# EAGLE design LAMPS_1-41 (EAGLE 6.3)
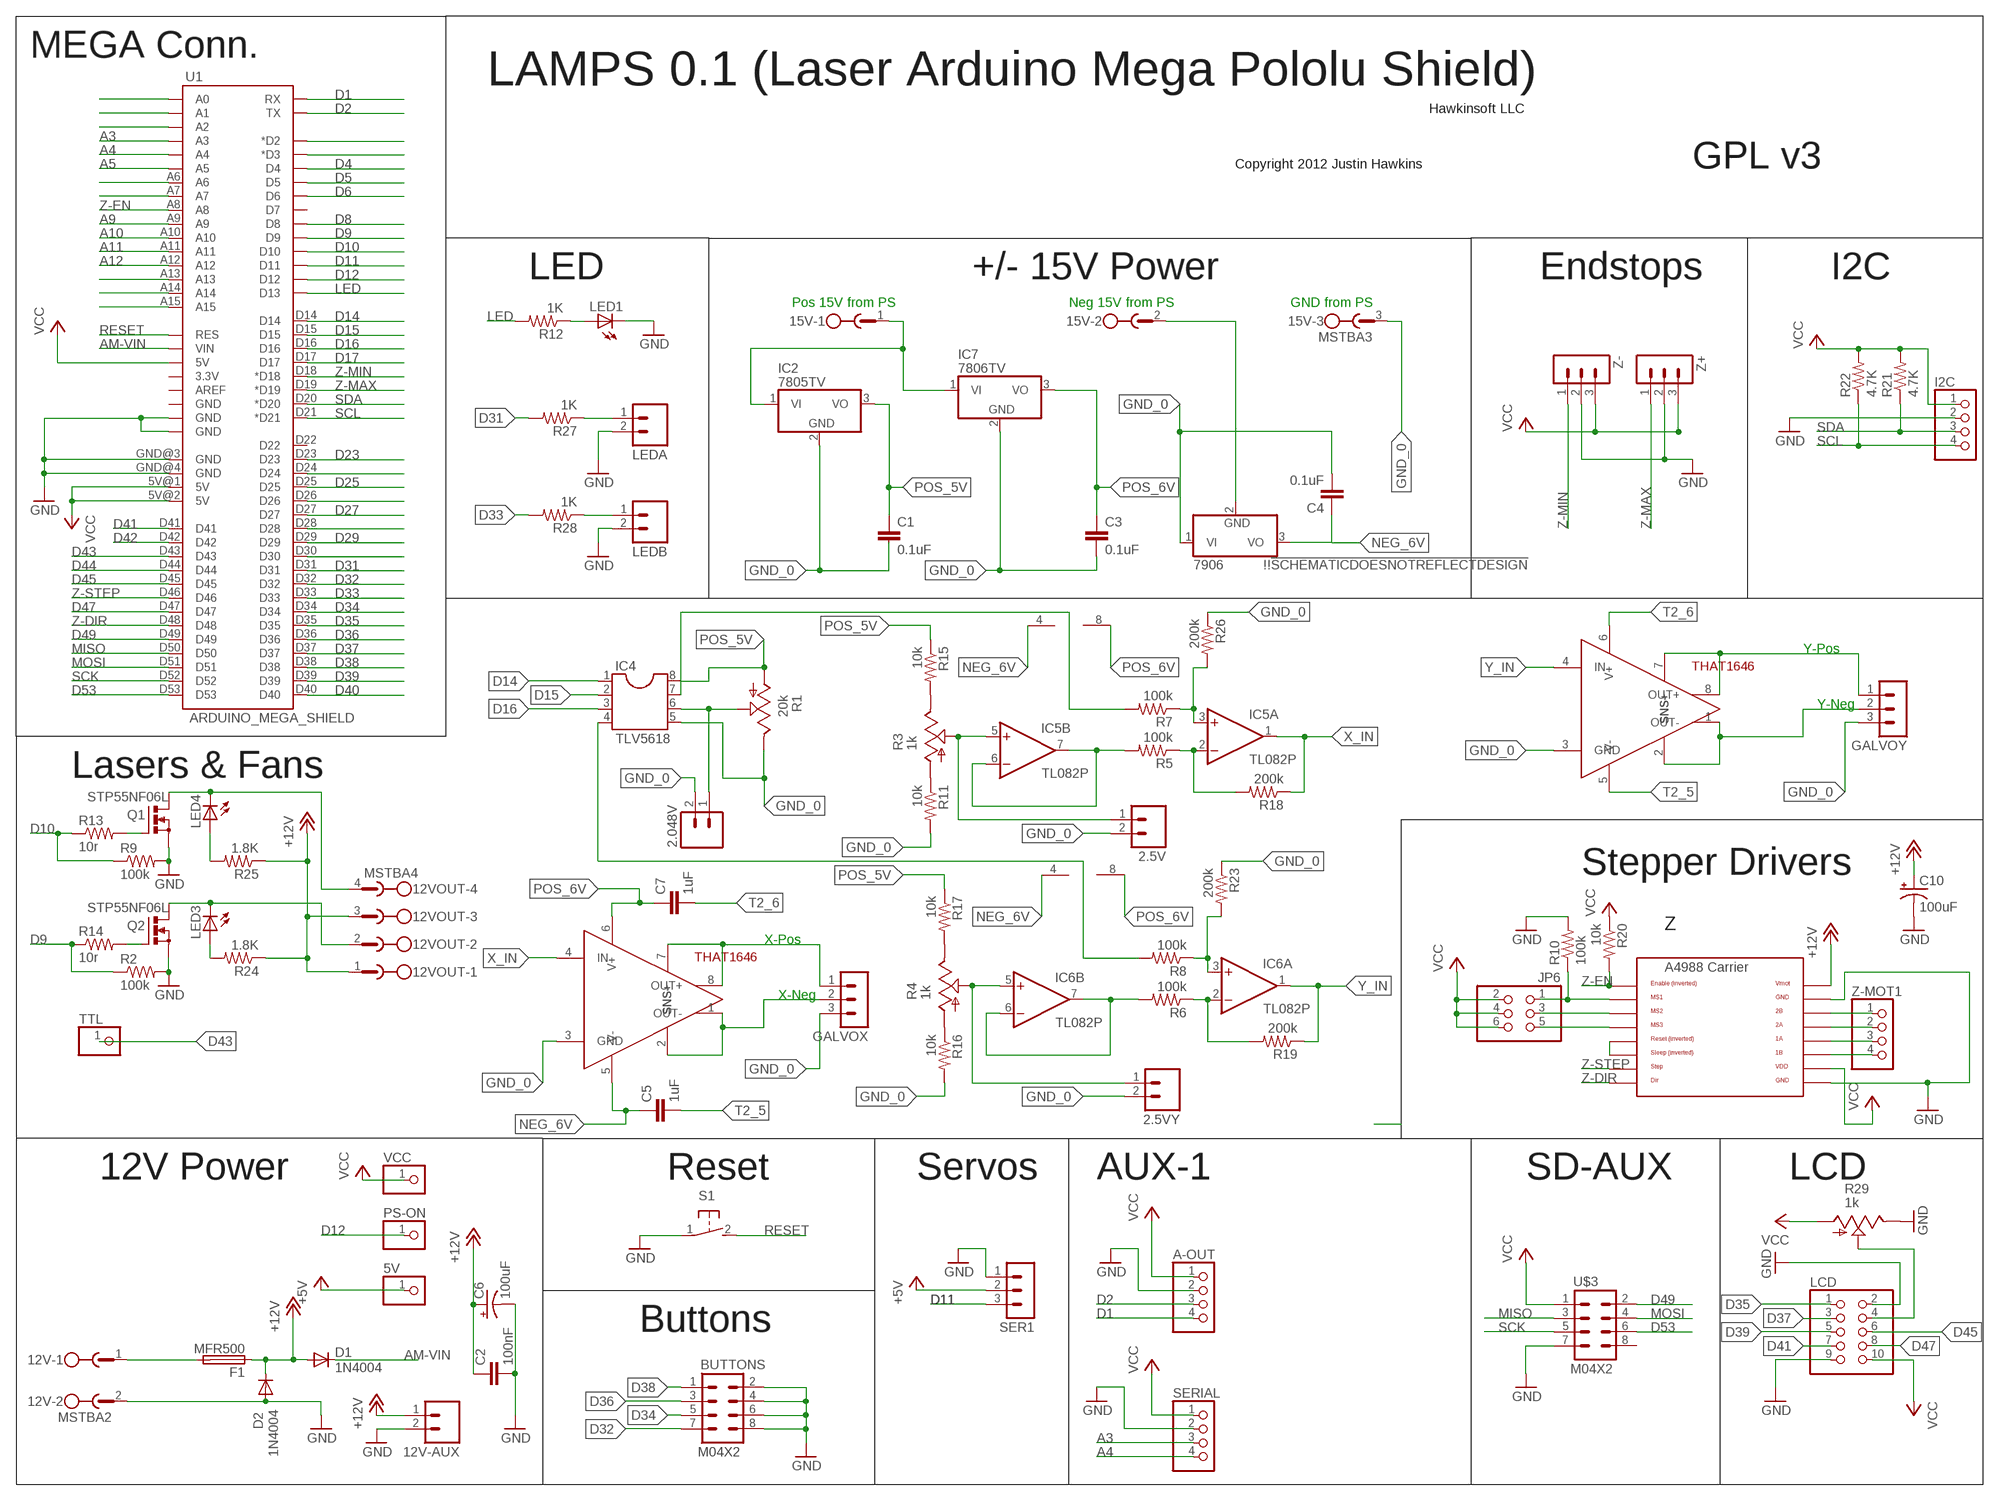
[diagram p0: schematic, sheet 1]

## Parts
2.5V  M02PTH  [1X02]
2.5VY  M02PTH  [1X02]
2.048V  M02PTH  [1X02]
5V  PINHD-1X1  [1X01]
12V  MSTBA2  [MSTBA2]
12V-AUX  M02PTH  [1X02]
12VOUT  MSTBA4  [MSTBA4]
15V  MSTBA3  [MSTBA3]
!!!SCHEMATICDOESNOTREFLECTDESIGN  7906  7805TV  [TO220V]
A-OUT  PINHD-1X4  [1X04]
BUTTONS  M04X2  [2X4]
C1  0.1uF  C2.5/2  [C2.5-2]
C2  100nF  C-EUC0805  [C0805]
C3  0.1uF  C2.5/2  [C2.5-2]
C4  0.1uF  C2.5/2  [C2.5-2]
C5  1uF  C2.5/2  [C2.5-2]
C6  100uF  CPOL-US153CLV-0605  [153CLV-0605]
C7  1uF  C2.5/2  [C2.5-2]
C10  100uF  CPOL-US153CLV-0605  [153CLV-0605]
D1  1N4004  [DO41-10]
D2  1N4004  [DO41-10]
F1  MFR500  PTCFUSE  [MFR500]
GALVOX  3PIN-HEADER  [3PIN-HEADER]
GALVOY  3PIN-HEADER  [3PIN-HEADER]
I2C  PINHD-1X4  [1X04]
IC2  7805TV  [TO220V]
IC4  TLV5618  DIL8S  [SOCKET-08]
IC5  TL082P  [DIL08]
IC6  TL082P  [DIL08]
IC7  7806TV  7805TV  [TO220V]
JP6  PINHD-2X3  [2X03]
LCD  PINHD-2X5  [2X05]
LED1  LEDCHIP-LED0805  [CHIP-LED0805]
LED3  LEDCHIP-LED0805  [CHIP-LED0805]
LED4  LEDCHIP-LED0805  [CHIP-LED0805]
LEDA  M02PTH  [1X02]
LEDB  M02PTH  [1X02]
PS-ON  PINHD-1X1  [1X01]
Q1  STP55NF06L  IRF512  [TO220BV]
Q2  STP55NF06L  IRF512  [TO220BV]
R1  20k  TRIM_US-B25P  [B25P]
R2  100k  R-US_R0805  [R0805]
R3  1k  TRIM_US-B25P  [B25P]
R4  1k  TRIM_US-B25P  [B25P]
R5  100k  R-US_R0805  [R0805]
R6  100k  R-US_R0805  [R0805]
R7  100k  R-US_R0805  [R0805]
R8  100k  R-US_R0805  [R0805]
R9  100k  R-US_R0805  [R0805]
R10  100k  R-US_R0805  [R0805]
R11  10k  R-US_R0805  [R0805]
R12  1K  R-US_R0805  [R0805]
R13  10r  R-US_R0805  [R0805]
R14  10r  R-US_M0805  [M0805]
R15  10k  R-US_R0805  [R0805]
R16  10k  R-US_R0805  [R0805]
R17  10k  R-US_R0805  [R0805]
R18  200k  R-US_R0805  [R0805]
R19  200k  R-US_R0805  [R0805]
R20  10k  R-US_R0805  [R0805]
R21  4.7K  R-US_R0805  [R0805]
R22  4.7K  R-US_R0805  [R0805]
R23  200k  R-US_R0805  [R0805]
R24  1.8K  R-US_R0805  [R0805]
R25  1.8K  R-US_R0805  [R0805]
R26  200k  R-US_R0805  [R0805]
R27  1K  R-US_R0805  [R0805]
R28  1K  R-US_R0805  [R0805]
R29  1k  TRIM_US-B25P  [B25P]
S1  31-XX  [B3F-31XX]
SER1  3PIN-HEADER  [3PIN-HEADER]
SERIAL  PINHD-1X4  [1X04]
TTL  PINHD-1X1  [1X01]
U1  ARDUINO_MEGA_SHIELD  [ARDUINO_MEGA_SHIELD]
U$1  THAT1646  [THAT1646]
U$3  M04X2  [2X4]
U$4  THAT1646  [THAT1646]
U$8  A4988BREAKOUT  [A4988BREAKOUT]
VCC  PINHD-1X1  [1X01]
Z+  3PIN-HEADER  [3PIN-HEADER]
Z-  3PIN-HEADER  [3PIN-HEADER]
Z-MOT1  PINHD-1X4  [1X04]

## Nets
+5V: 5V.1 SER1.2
+12V [power]: 12V-AUX.1 12VOUT.1 12VOUT.3 C2.1 C6.+ C10.+ D1.A D2.C F1.1 R24.1 R25.1 U$8.VMOT
A3: SERIAL.3 U1.A3
A4: SERIAL.4 U1.A4
A5: U1.A5
A9: U1.A9
A10: U1.A10
A11: U1.A11
A12: U1.A12
AM-VIN [power]: D1.C U1.VIN
D1: A-OUT.4 U1.RX
D2: A-OUT.3 U1.TX
D4: U1.D4
D5: U1.D5
D6: U1.D6
D8: U1.D8
D9: R2.1 R14.1 U1.D9
D10: R9.1 R13.1 U1.D10
D11: SER1.3 U1.D11
D12: PS-ON.1 U1.D12
D14: IC4.1 U1.D14
D15: IC4.2 U1.D15
D16: IC4.3 U1.D16
D17: U1.D17
D23: U1.D23
D25: U1.D25
D27: U1.D27
D29: U1.D29
D31: R27.2 U1.D31
D32: BUTTONS.7 U1.D32
D33: R28.2 U1.D33
D34: BUTTONS.5 U1.D34
D35: LCD.1 U1.D35
D36: BUTTONS.3 U1.D36
D37: LCD.3 U1.D37
D38: BUTTONS.1 U1.D38
D39: LCD.5 U1.D39
D40: U1.D40
D41: LCD.7 U1.D41
D42: U1.D42
D43: TTL.1 U1.D43
D44: U1.D44
D45: LCD.6 U1.D45
D47: LCD.8 U1.D47
D49: U1.D49 U$3.2
D53: U1.D53 U$3.6
E0-DIR: U1.D28
E0-EN: U1.D24
E0-STEP: U1.D26
E1-EN: U1.D30
GND: 12V-AUX.2 12V.2 A-OUT.2 BUTTONS.2 BUTTONS.4 BUTTONS.6 BUTTONS.8 C2.2 C6.- C10.- D2.A I2C.2 LCD.2 LCD.9 LED1.C LEDA.2 LEDB.2 Q1.S Q2.S R2.2 R9.2 R10.2 R29.E S1.1(P) SER1.1 SERIAL.2 U1.GND@0(GND) U1.GND@1(GND) U1.GND@3(GND) U1.GND@4(GND) U$3.7 U$8.GND U$8.GND@0(GND) Z+.2 Z-.2
GND_0: 2.5V.2 2.5VY.2 2.048V.2 15V.3 !!!SCHEMATICDOESNOTREFLECTDESIGN.1(VI) C1.2 C3.2 C4.2 GALVOX.3 GALVOY.3 IC2.2(GND) IC4.5 IC7.2(GND) R1.E R11.2 R16.2 R23.1 R26.1 U$1.3(GND) U$4.3(GND)
LED: R12.2 U1.D13
MISO: U1.D50 U$3.3
MOSI: U1.D51 U$3.4
N$1: 12VOUT.2 LED3.C Q2.D
N$2 [power]: 15V.1 IC2.1(VI) IC7.1(VI)
N$3 [power]: 15V.2 !!!SCHEMATICDOESNOTREFLECTDESIGN.2(GND)
N$4: R4.A R16.1
N$5: R4.E R17.2
N$6: 2.048V.1 IC4.6 R1.S
N$7: 12VOUT.4 LED4.C Q1.D
N$8: R3.A R11.1
N$9: R3.E R15.2
N$10: 2.5VY.1 IC6.5(B:+IN) R4.S
N$11: 2.5V.1 IC5.5(B:+IN) R3.S
N$12: GALVOX.2 U$1.1(OUT-) U$1.2(SNS-)
N$13: GALVOX.1 U$1.7(SNS+) U$1.8(OUT+)
N$14: IC5.6(B:-IN) IC5.7(B:OUT) R5.2
N$15: IC5.2(A:-IN) R5.1 R18.2
N$16: IC4.7 R7.2
N$17: IC5.3(A:+IN) R7.1 R26.2
N$18: IC6.6(B:-IN) IC6.7(B:OUT) R6.2
N$19: LEDA.1 R27.1
N$20: IC6.2(A:-IN) R6.1 R19.2
N$21: IC4.4 R8.2
N$22: IC6.3(A:+IN) R8.1 R23.2
N$23: LEDB.1 R28.1
N$24: GALVOY.2 U$4.1(OUT-) U$4.2(SNS-)
N$25: GALVOY.1 U$4.7(SNS+) U$4.8(OUT+)
N$29: LCD.4 R29.S
N$37: JP6.3 U$8.MS2
N$38: U$8.RST U$8.SLP(SLEEP)
N$39: JP6.5 U$8.MS3
N$40: JP6.1 R10.1 U$8.MS1
N$41: U$8.2B Z-MOT1.1
N$42: U$8.2A Z-MOT1.2
N$43: U$8.1A Z-MOT1.3
N$44: U$8.1B Z-MOT1.4
N$45: LED3.A R24.2
N$46: LED1.A R12.1
N$47: Q2.G R14.2
N$48: Q1.G R13.2
N$50: LED4.A R25.2
N$54 [power]: 12V.1 F1.2
NEG_6V: !!!SCHEMATICDOESNOTREFLECTDESIGN.3(VO) C4.1 C5.1 IC5.4(P:V-) IC6.4(P:V-) U$1.5(V-)
POS_5V: C1.1 IC2.3(VO) IC4.8 R1.A R15.1 R17.1
POS_6V: C3.1 C7.1 IC5.8(P:V+) IC6.8(P:V+) IC7.3(VO) U$1.6(V+)
RESET: S1.2(S) U1.RES
SCK: U1.D52 U$3.5
SCL: I2C.4 R22.1 U1.D21(*D21)
SDA: I2C.3 R21.1 U1.D20(*D20)
T2_5: C5.2 U$4.5(V-)
T2_6: C7.2 U$4.6(V+)
THERM0: U1.A13
THERM1: U1.A14
THERM2: U1.A15
VCC: A-OUT.1 I2C.1 JP6.2 JP6.4 JP6.6 LCD.10 R20.1 R21.2 R22.2 R29.A SERIAL.1 U1.5V@0(5V) U1.5V@1(5V) U1.5V@2(5V) U$3.1 U$8.VDD VCC.1 Z+.3 Z-.3
X-DIR: U1.A1
X-MAX: U1.D2(*D2)
X-MIN: U1.D3(*D3)
X-STEP: U1.A0
X_IN: IC5.1(A:OUT) R18.1 U$1.4(IN)
Y-DIR: U1.A7
Y-EN: U1.A2
Y-STEP: U1.A6
Y_IN: IC6.1(A:OUT) R19.1 U$4.4(IN)
Z-DIR: U1.D48 U$8.DIR
Z-EN: R20.2 U1.A8 U$8.EN
Z-MAX: U1.D19(*D19) Z+.1
Z-MIN: U1.D18(*D18) Z-.1
Z-STEP: U1.D46 U$8.STEP
Unconnected: U1.3.3V U1.AREF U1.D7 U1.D22 U1.GND@2(GND) U$3.8

## Notes on the sheet
- MEGA Conn.
- LAMPS 0.1 (Laser Arduino Mega Pololu Shield)
- Hawkinsoft LLC
- Copyright 2012 Justin Hawkins | GPL v3
- LED | +/- 15V Power | Endstops | I2C
- Pos 15V from PS | Neg 15V from PS | GND from PS
- Y-Pos
- Y-Neg
- Lasers & Fans
- Stepper Drivers
- Z
- X-Pos
- X-Neg
- 12V Power | Reset | Servos | AUX-1 | SD-AUX | LCD
- Buttons

## Library data of the parts
2.5V 2.5VY 2.048V 12V-AUX LEDA LEDB = SparkFun:M02: Header 2 Standard 2-pin 0.1" header. Use with straight break away headers (SKU : PRT-00116), right angle break away headers (PRT-00553), swiss pins (PRT-00743), machine pins (PRT-00117), and female headers (PRT-00115). Molex polarized connector foot print use with SKU : PRT-08233 with associated crimp pins and housings.
5V PS-ON VCC = adafruit:PINHD-1X1: Pin header 1x1 for 0.1" spacing With round pins
12V = con-phoenix-508:MSTBA2: PHOENIX; MF: FARNELL; MPN: 1757242; OC_FARNELL: 3705171; OC_NEWARK: 71C4161
12VOUT = con-phoenix-508:MSTBA4: PHOENIX; MF: FARNELL; MPN: 1757268; OC_FARNELL: 3705195; OC_NEWARK: 71C4163
15V = con-phoenix-508:MSTBA3: PHOENIX; MF: FARNELL; MPN: 1757255; OC_FARNELL: 3705183; OC_NEWARK: 71C4162
!!!SCHEMATICDOESNOTREFLECTDESIGN IC2 IC7 = linear:78*: Positive VOLTAGE REGULATOR Source: http://cache.national.com/ds/LM/LM78L05.pdf http://www.fairchildsemi.com/ds/LM/LM7805.pdf
A-OUT I2C SERIAL Z-MOT1 = RepRapjr:PINHD-1X4: PIN HEADER
BUTTONS U$3 = SparkFun:M04X2
C1 C3-C5 C7 = capacitor-wima:C: CAPACITOR naming: grid - package width
C2 = resistor:C-EU: CAPACITOR, European symbol
C6 C10 = adafruit:CPOL-US: POLARIZED CAPACITOR, American symbol
D1 D2 = diode:1N4004: DIODE general purpose rectifier, 1 A
F1 = RepRapjr:PTCFUSE: LITTLEFUSE Picofuse/slow Littlefuse
GALVOX GALVOY SER1 Z+ Z- = ultimachine:3PIN-HEADER: PIN HEADER
IC4 = ic-package:DIL8: Dual In Line / Socket
IC5 IC6 = linear:TL082: OP AMP
JP6 = pinhead:PINHD-2X3: PIN HEADER
LCD = pinhead:PINHD-2X5: PIN HEADER
LED1 LED3 LED4 = led:LED: LED OSRAM: - CHIPLED LG R971, LG N971, LY N971, LG Q971, LY Q971, LO R971, LY R971 LH N974, LH R974 LS Q976, LO Q976, LY Q976 LO Q996 - Hyper CHIPLED LW Q18S LB Q993, LB Q99A, LB R99A - SideLED LS A670, LO A670, LY A670, LG A670, LP A670 LB A673, LV A673, LT A673, LW A673 LH A674 LY A675 LS A676, LA A676, LO A676, LY A676, LW A676 LS A679, LY A679, LG A679 - Hyper Micro SIDELED® LS Y876, LA Y876, LO Y876, LY Y876 LT Y87S - SmartLED LW L88C, LW L88S LB L89C, LB L89S, LG L890 LS L89K, LO L89K, LY L89K LS L896, LA L896, LO L896, LY L896 - TOPLED LS T670, LO T670, LY T670, LG T670, LP T670 LSG T670, LSP T670, LSY T670, LOP T670, LYG T670 LG T671, LOG T671, LSG T671 LB T673, LV T673, LT T673, LW T673 LH T674 LS T676, LA T676, LO T676, LY T676, LB T676, LH T676, LSB T676, LW T676 LB T67C, LV T67C, LT T67C, LS T67K, LO T67K, LY T67K, LW E67C LS E67B, LA E67B, LO E67B, LY E67B, LB E67C, LV E67C, LT E67C LW T67C LS T679, LY T679, LG T679 LS T770, LO T770, LY T770, LG T770, LP T770 LB T773, LV T773, LT T773, LW T773 LH T774 LS E675, LA E675, LY E675, LS T675 LS T776, LA T776, LO T776, LY T776, LB T776 LHGB T686 LT T68C, LB T68C - Hyper Mini TOPLED® LB M676 - Mini TOPLED Santana® LG M470 LS M47K, LO M47K, LY M47K Source: http://www.osram.convergy.de LUXEON: - LUMILED® LXK2-PW12-R00, LXK2-PW12-S00, LXK2-PW14-U00, LXK2-PW14-V00 LXK2-PM12-R00, LXK2-PM12-S00, LXK2-PM14-U00 LXK2-PE12-Q00, LXK2-PE12-R00, LXK2-PE12-S00, LXK2-PE14-T00, LXK2-PE14-U00 LXK2-PB12-K00, LXK2-PB12-L00, LXK2-PB12-M00, LXK2-PB14-N00, LXK2-PB14-P00, LXK2-PB14-Q00 LXK2-PR12-L00, LXK2-PR12-M00, LXK2-PR14-Q00, LXK2-PR14-R00 LXK2-PD12-Q00, LXK2-PD12-R00, LXK2-PD12-S00 LXK2-PH12-R00, LXK2-PH12-S00 LXK2-PL12-P00, LXK2-PL12-Q00, LXK2-PL12-R00 Source: www.luxeon.com KINGBRIGHT: KA-3528ASYC Source: www.kingbright.com
Q1 Q2 = transistor-power:IRF512: N-CHANNEL MOS FET
R1 R3 R4 R29 = pot:TRIM_US-: POTENTIOMETER
R2 R5-R12 R15-R28 = adafruit:R-US_: RESISTOR, American symbol
R13 R14 = resistor:R-US_: RESISTOR, American symbol
S1 = switch-omron:31-XX: OMRON SWITCH; MPN: B3F-3100; OC_FARNELL: 959704; OC_NEWARK: 36M3582
TTL = pinhead:PINHD-1X1: PIN HEADER
U1 = RepRapjr:ARDUINO_MEGA_SHIELD
U$1 U$4 = THAT1646:THAT1646: THAT 1646 Balanced Line Driver (DIP) Datasheet: http://www.thatcorp.com/datashts/THAT_1606-1646_Datasheet.pdf
U$8 = RepRapjr:A4988BREAKOUT

## Net classes
1 power: width 1.016 mm

## Board
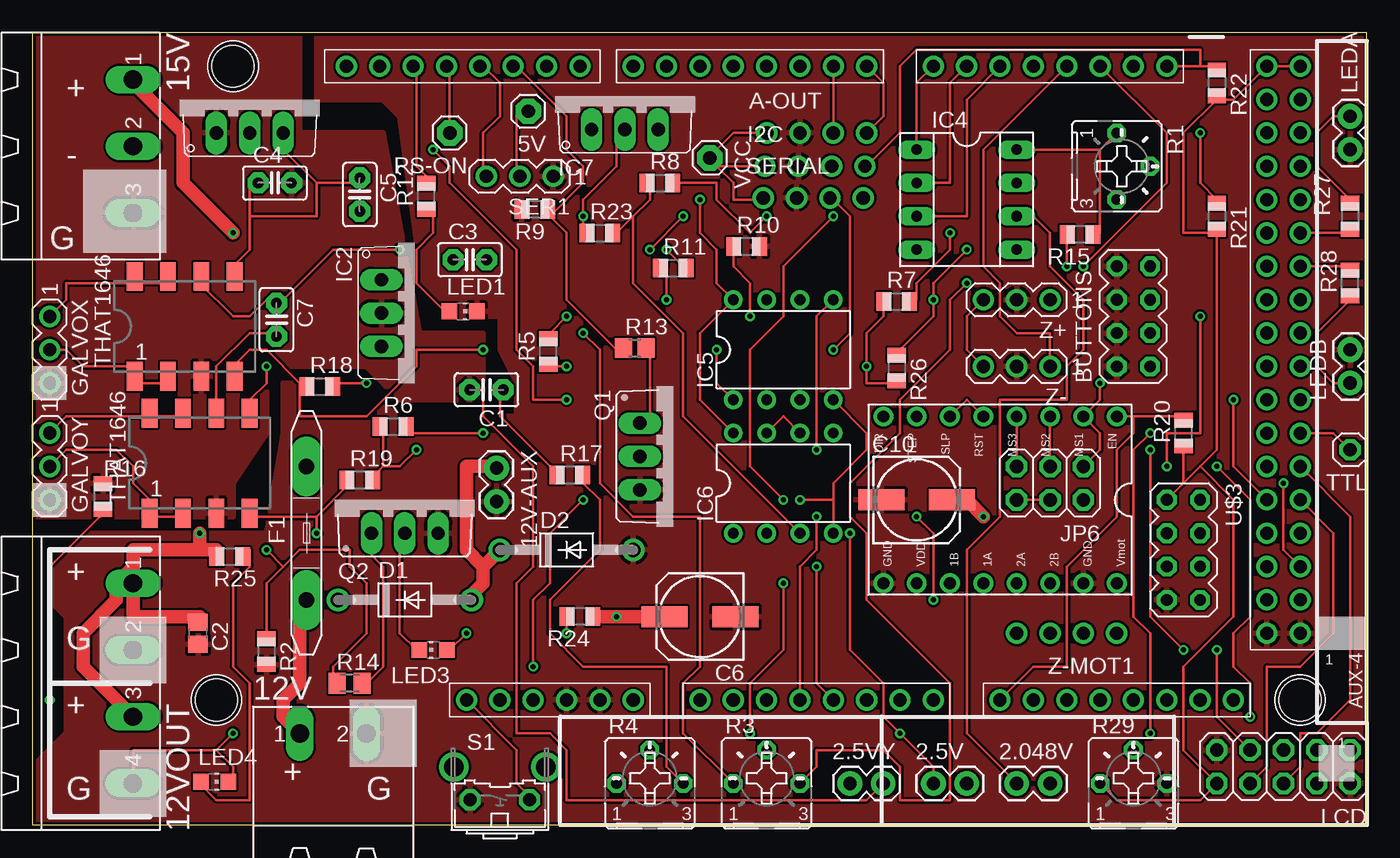
[diagram p1: board, top side]
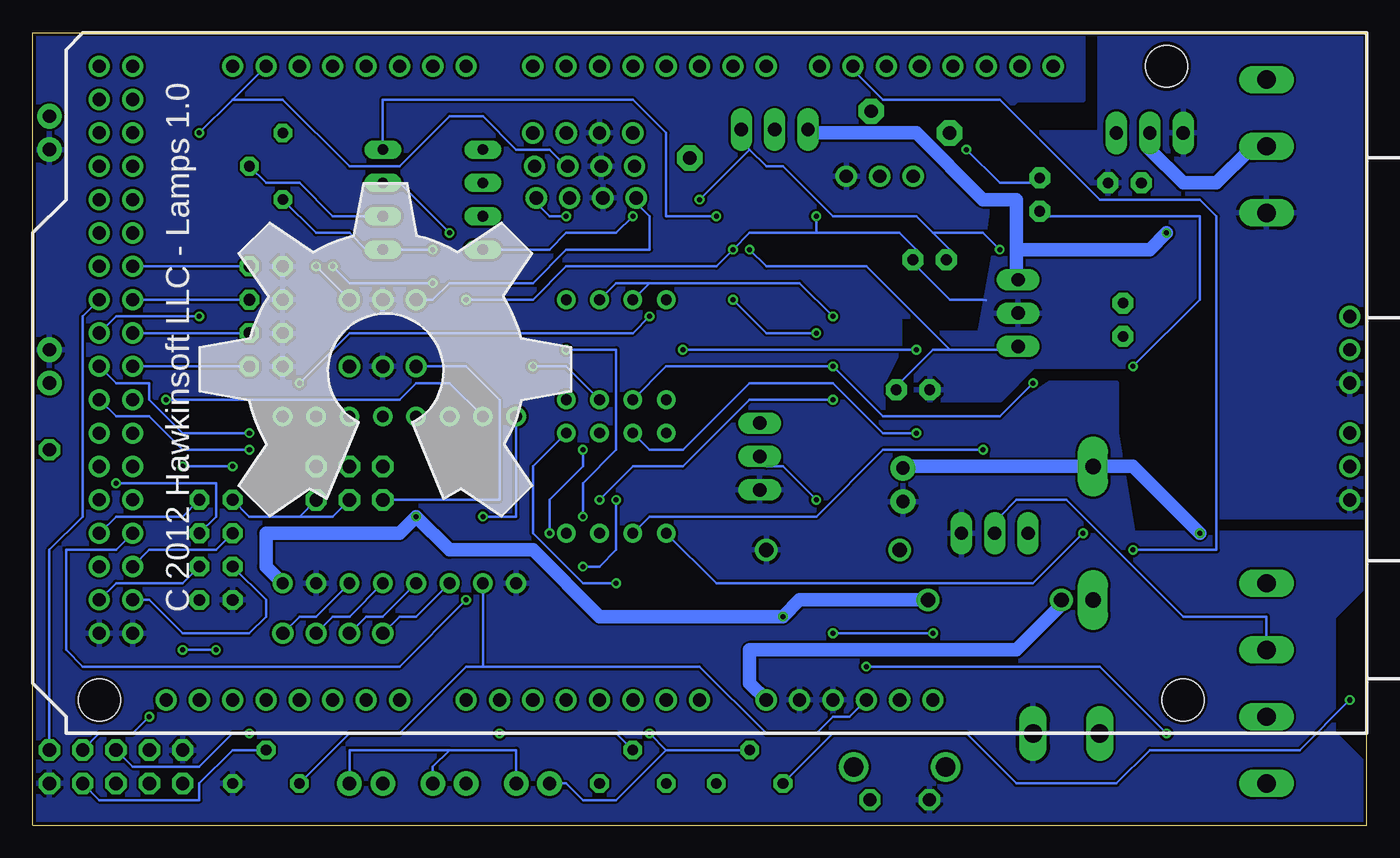
[diagram p2: board, bottom side, seen from below]

Size 101.6 x 60.32 mm. Coordinates in mm from the lower left corner, seen from the top.
Outline: 101.6,60.31 101.6,0 0.01,0
Outline: 0,0 0,60.31
Outline: 101.6,60.32 0.01,60.32
Copper layers (1*16): Top 0.035mm / dielectric 1.5mm / Bottom 0.035mm
Design rules "GoldPhoenix": minimum track width 7mil, minimum drill 15mil, track to track 7mil, track to pad 7mil, pad to pad 7mil, via to via 7mil, smd to smd 7mil, copper to edge 10mil, drill to drill 8mil, minimum pad ring 12mil, minimum via ring 7mil, stop-mask expansion 4mil, vias tented up to drill 25mil, thermal gap 10mil

### Footprints (pad centres in the part's own frame; a part is rotated, then mirrored left to right if it is on the bottom)
1X02 = drill 1.016 pad 1.88: 1 0,0; 2 2.54,0
1X01 = drill 1.016 pad 1.93 octagon: 1 0,0
MSTBA2 = drill 1.397 long: 1 -2.54,5.08; 2 2.54,5.08
MSTBA4 = drill 1.397 long: 1 -7.62,5.08; 2 -2.54,5.08; 3 2.54,5.08; 4 7.62,5.08
MSTBA3 = drill 1.397 long: 1 -5.08,5.08; 2 0,5.08; 3 5.08,5.08
TO220V = drill 1.016 long: 1 -2.54,-2.54; 2 0,-2.54; 3 2.54,-2.54
1X04 = drill 1.016: 1 -2.54,0; 2 0,0; 3 2.54,0; 4 5.08,0
2X4 = drill 0.9 pad 1.422 octagon: 1 -3.81,-1.27; 2 -3.81,1.27; 3 -1.27,-1.27; 4 -1.27,1.27; 5 1.27,-1.27; 6 1.27,1.27; 7 3.81,-1.27; 8 3.81,1.27
C2.5-2 = drill 0.813 pad 1.6 octagon: 1 -1.27,0; 2 1.27,0
C0805 = smd 1.3 x 1.5: 1 -0.85,0; 2 0.85,0
153CLV-0605 = smd 3.5 x 1.6: + 2.7,0; - -2.7,0
DO41-10 = drill 1.118: A 5.08,0; C -5.08,0
MFR500 = drill 1.2 pad 2.3 long: 1 -5.08,0; 2 5.08,0
3PIN-HEADER = drill 1.016: 1 -2.54,0; 2 0,0; 3 2.54,0
SOCKET-08 = drill 0.813 long: 1 -3.81,-3.81; 2 -1.27,-3.81; 3 1.27,-3.81; 4 3.81,-3.81; 5 3.81,3.81; 6 1.27,3.81; 7 -1.27,3.81; 8 -3.81,3.81
DIL08 = drill 0.813 pad 1.27: 1 -3.81,-3.81; 2 -1.27,-3.81; 3 1.27,-3.81; 4 3.81,-3.81; 5 3.81,3.81; 6 1.27,3.81; 7 -1.27,3.81; 8 -3.81,3.81
2X03 = drill 1.016 octagon: 1 -2.54,-1.27; 2 -2.54,1.27; 3 0,-1.27; 4 0,1.27; 5 2.54,-1.27; 6 2.54,1.27
2X05 = drill 1.016 octagon: 1 -5.08,-1.27; 2 -5.08,1.27; 3 -2.54,-1.27; 4 -2.54,1.27; 5 0,-1.27; 6 0,1.27; 7 2.54,-1.27; 8 2.54,1.27; 9 5.08,-1.27; 10 5.08,1.27
CHIP-LED0805 = smd 1.2 x 1.2: A 0,-1.05; C 0,1.05
TO220BV = drill 1.016 long: D 0,-2.54; G -2.54,-2.54; S 2.54,-2.54
B25P = drill 0.813 octagon: A -2.54,0; E 2.54,0; S 0,2.54
R0805 = smd 1.1 x 1.4: 1 -1,0; 2 1,0
R0805' = smd 1.3 x 1.5: 1 -0.85,0; 2 0.85,0
M0805 = smd 1.3 x 1.6: 1 -0.95,0; 2 0.95,0
B3F-31XX = drill 1.016 octagon: 1 -2.261,-1.245; 2 2.261,-1.245 | drill 1.499 pad 2.159: 3 -3.505,1.245; 4 3.505,1.245
1X01' = drill 1.016 octagon: 1 0,0
ARDUINO_MEGA_SHIELD = drill 1 pad 1.422: 3.3V 35.56,2.54; 5V@0 38.1,2.54; 5V@1 93.98,50.8; 5V@2 96.52,50.8; A0 50.8,2.54; A1 53.34,2.54; A2 55.88,2.54; A3 58.42,2.54; A4 60.96,2.54; A5 63.5,2.54; A6 66.04,2.54; A7 68.58,2.54; A8 73.66,2.54; A9 76.2,2.54; A10 78.74,2.54; A11 81.28,2.54; A12 83.82,2.54; A13 86.36,2.54; A14 88.9,2.54; A15 91.44,2.54; AREF 23.876,50.8; D2 58.42,50.8; D3 55.88,50.8; D4 53.34,50.8; D5 50.8,50.8; D6 48.26,50.8; D7 45.72,50.8; D8 41.656,50.8; D9 39.116,50.8; D10 36.576,50.8; D11 34.036,50.8; D12 31.496,50.8; D13 28.956,50.8; D14 68.58,50.8; D15 71.12,50.8; D16 73.66,50.8; D17 76.2,50.8; D18 78.74,50.8; D19 81.28,50.8; D20 83.82,50.8; D21 86.36,50.8; D22 93.98,48.26; D23 96.52,48.26; D24 93.98,45.72; D25 96.52,45.72; D26 93.98,43.18; D27 96.52,43.18; D28 93.98,40.64; D29 96.52,40.64; D30 93.98,38.1; D31 96.52,38.1; D32 93.98,35.56; D33 96.52,35.56; D34 93.98,33.02; D35 96.52,33.02; D36 93.98,30.48; D37 96.52,30.48; D38 93.98,27.94; D39 96.52,27.94; D40 93.98,25.4; D41 96.52,25.4; D42 93.98,22.86; D43 96.52,22.86; D44 93.98,20.32; D45 96.52,20.32; D46 93.98,17.78; D47 96.52,17.78; D48 93.98,15.24; D49 96.52,15.24; D50 93.98,12.7; D51 96.52,12.7; D52 93.98,10.16; D53 96.52,10.16; GND@0 40.64,2.54; GND@1 43.18,2.54; GND@2 26.416,50.8; GND@3 93.98,7.62; GND@4 96.52,7.62; RES 33.02,2.54; RX 63.5,50.8; TX 60.96,50.8; VIN 45.72,2.54 | hole 3.2: 96.52,2.54; 13.97,2.54; 15.24,50.8
THAT1646 = smd 1.2 x 2.2: 1 -3.81,-3.8; 2 -1.27,-3.8; 3 1.27,-3.8; 4 3.81,-3.8; 5 3.81,3.8; 6 1.27,3.8; 7 -1.27,3.8; 8 -3.81,3.8
A4988BREAKOUT = drill 0.9: 1A 8.89,1.27; 1B 11.43,1.27; 2A 6.35,1.27; 2B 3.81,1.27; DIR 16.51,-11.43; EN -1.27,-11.43; GND 16.51,1.27; GND@0 1.27,1.27; MS1 1.27,-11.43; MS2 3.81,-11.43; MS3 6.35,-11.43; RST 8.89,-11.43; SLP 11.43,-11.43; STEP 13.97,-11.43; VDD 13.97,1.27; VMOT -1.27,1.27

### Placement (x,y rotation side)
2.5V  68.59,3.17 0 top
2.5VY  62.24,3.17 0 top
2.048V  74.94,3.17 0 top
5V  37.73,54.36 180 top
12V  22.87,1.9 0 top
12V-AUX  35.32,27.18 270 top
12VOUT  2.55,10.79 270 top
15V  2.55,51.69 270 top
!!!SCHEMATICDOESNOTREFLECTDESIGN  16.52,55.24 0 top
A-OUT  58.43,52.7 0 top
BUTTONS  83.83,38.73 90 top
C1  34.56,33.15 180 top
C2  12.59,14.6 270 top
C3  33.29,43.05 0 top
C4  18.43,48.89 0 top
C5  24.9,48.01 270 top
C6  50.81,15.87 180 top
C7  18.55,38.48 270 top
C10  67.32,24.77 0 top
D1  28.33,17.14 0 top
D2  40.65,20.95 0 top
F1  20.84,22.23 270 top
GALVOX  1.28,36.2 270 top
GALVOY  1.28,27.3 270 top
I2C  58.31,50.16 0 top
IC2  29.1,38.99 270 top
IC4  71.13,47.62 270 top
IC5  57.16,36.2 0 top
IC6  57.16,26.03 0 top
IC7  45.1,55.5 0 top
JP6  77.48,26.03 180 top
LCD  95.26,4.44 180 top
LED1  32.78,39.12 270 top
LED3  30.49,13.33 90 top
LED4  13.86,3.3 270 top
LEDA  100.34,53.97 270 top
LEDB  100.34,33.65 90 top
PS-ON  31.76,52.7 180 top
Q1  48.78,28.07 270 top
Q2  28.33,24.77 0 top
R1  82.56,50.16 270 top
R2  17.79,13.21 270 top
R3  55.89,3.17 0 top
R4  47,3.17 0 top
R5  39.26,36.07 90 top
R6  27.44,30.35 0 top
R7  65.8,39.88 0 top
R8  47.76,48.89 0 top
R9  38.24,46.86 180 top
R10  54.37,44.07 0 top
R11  48.78,42.42 0 top
R12  29.98,47.88 90 top
R13  10r  [R0805']  45.86,36.32 0 top
R14  24.14,10.79 0 top
R15  79.77,44.96 180 top
R16  5.35,25.02 90 top
R17  40.91,26.67 0 top
R18  21.86,33.4 0 top
R19  24.9,26.29 0 top
R20  87.64,29.84 90 top
R21  90.18,46.35 270 top
R22  90.18,56.51 270 top
R23  43.19,45.09 0 top
R24  41.67,15.87 180 top
R25  15,20.45 0 top
R26  65.8,34.8 270 top
R27  100.34,46.35 270 top
R28  100.34,41.27 90 top
R29  83.83,3.17 0 top
S1  35.57,3.17 0 top
SER1  37.1,49.4 180 top
SERIAL  58.18,47.75 0 top
TTL  [1X01']  100.34,28.57 180 top
U1  0.01,6.98 0 top
U$1  11.57,37.97 0 top
U$2  [OSHW_FILLX1000_NOTEXT]  88.91,23.49 0 bottom
U$3  87.64,20.95 270 top
U$4  12.71,27.56 0 top
U$8  81.29,19.69 180 top
VCC  51.57,50.8 270 top
Z+  74.94,40 180 top
Z-  74.94,34.92 180 top
Z-MOT1  80.02,14.6 180 top

### Tracks (layer width: path | path; a pad name or v marks a point on that pad's centre or on a via)
+5V
  Top 0.178: SER1.2 36.84,50.16 36.84,53.97 5V.1
+12V  (via drill 0.38)
  Top 1.016: v72.4,23.49 71.13,24.77 C10.+ | 12.71,20.95 7.63,20.95 7.63,19.69 | 12.71,20.95 13.98,20.95 R25.1 | 7.63,19.69 12VOUT.1 7.63,15.87 12.71,15.87 C2.1 | 12VOUT.3 3.82,12.06 3.82,14.6 6.36,17.14 6.36,18.41 7.63,19.69 | C6.+ v44.46,15.87 R24.1 | 34.3,19.69 34.3,18.41 33.03,17.14 D1.A | D2.C 34.3,19.69 | 34.3,19.69 33.03,20.95 33.03,27.3 35.57,27.3 12V-AUX.1 | v12.71,22.23 12.71,20.95
  Bottom 1.016: U$8.VMOT 83.83,19.69 83.83,22.23 73.67,22.23 v72.4,23.49 69.86,20.95 63.51,20.95 58.43,15.87 v44.46,15.87 43.19,17.14 D1.A 33.03,17.14 | 12V-AUX.1 35.57,27.3 F1.1 17.79,27.3 v12.71,22.23
A3  (via drill 0.38)
  Top 0.178: U1.A3 58.43,19.69 59.7,20.95 v59.7,23.49 | v60.97,36.2 62.24,37.46 62.24,46.35 60.97,47.62 SERIAL.3
  Bottom 0.178: v59.7,23.49 59.7,26.03 57.16,28.57 57.16,36.2 v60.97,36.2
A4  (via drill 0.38)
  Top 0.178: U1.A4 59.7,10.79 v59.7,19.69 | v57.16,24.77 54.62,27.3 54.62,36.2 57.16,38.73 57.16,42.54 v60.97,46.35
  Bottom 0.178: v59.7,19.69 58.43,19.69 57.16,20.95 v57.16,24.77 | v60.97,46.35 62.24,46.35 63.51,47.62 SERIAL.4
AM-VIN
  Bottom 1.016: U1.VIN 47,10.79 47,13.33 26.68,13.33 22.87,17.14 D1.C
D1
  Top 0.178: U1.RX 64.78,56.51 64.78,53.97 A-OUT.4
D2
  Top 0.178: A-OUT.3 U1.TX
D9  (via drill 0.38)
  Top 0.178: R2.1 17.79,18.41 19.06,19.69 | 19.06,19.69 20.33,20.95 24.14,20.95 24.14,19.69 25.41,18.41 25.41,14.6 22.87,12.06 22.87,10.79 R14.1 | 19.06,19.69 v17.79,20.95
  Bottom 0.178: v17.79,20.95 11.44,20.95 11.44,46.35 12.71,47.62 20.33,47.62 27.95,55.24 36.84,55.24 39.38,57.79 U1.D9
D10
  Top 0.178: 39.38,46.35 40.65,45.09 40.65,40 44.46,36.2 R13.1 | 39.38,46.35 41.92,48.89 41.92,50.16 40.65,51.43 40.65,53.97 36.84,57.79 U1.D10 | 39.38,46.35 R9.1
D11
  Top 0.178: U1.D11 34.3,57.79 35.57,56.51 35.57,53.97 34.3,52.7 34.3,50.16 SER1.3
D12
  Top 0.178: PS-ON.1 31.76,57.79 U1.D12
D14
  Top 0.178: IC4.1 67.32,56.51 U1.D14
D15
  Top 0.178: IC4.2 69.86,48.89 69.86,56.51 U1.D15
D16
  Top 0.178: IC4.3 71.13,46.35 71.13,55.24 U1.D16
D31
  Top 0.178: U1.D31 100.34,45.09 R27.2
D32
  Bottom 0.178: U1.D32 BUTTONS.7
D33
  Top 0.178: U1.D33 100.34,42.54 R28.2
D34
  Bottom 0.178: U1.D34 BUTTONS.5
D35
  Bottom 0.178: U1.D35 97.8,38.73 97.8,23.49 100.34,20.95 LCD.1
D36
  Bottom 0.178: U1.D36 BUTTONS.3
D37  (via drill 0.38)
  Top 0.178: v88.91,38.73 88.91,29.84 86.37,29.84 v86.37,27.3 | v90.18,27.3 92.72,24.77 92.72,15.87 91.45,14.6 91.45,12.06 92.72,10.79 v92.72,8.26
  Bottom 0.178: U1.D37 95.26,38.73 v88.91,38.73 | v90.18,27.3 v86.37,27.3 | v92.72,8.26 93.99,6.98 96.53,6.98 LCD.3
D38
  Bottom 0.178: U1.D38 BUTTONS.1
D39  (via drill 0.38)
  Top 0.178: v85.1,29.84 83.83,28.57 83.83,15.87 85.1,14.6 v85.1,6.98
  Bottom 0.178: U1.D39 95.26,33.65 92.72,33.65 92.72,32.38 90.18,29.84 v85.1,29.84 | v85.1,6.98 86.37,6.98 88.91,4.44 93.99,4.44 LCD.5
D41  (via drill 0.38)
  Top 0.178: v85.1,28.57 85.1,15.87 v87.64,13.33 | v90.18,13.33 90.18,8.26 LCD.7
  Bottom 0.178: U1.D41 95.26,31.11 92.72,31.11 90.18,28.57 v85.1,28.57 | v90.18,13.33 v87.64,13.33
D43
  Top 0.178: U1.D43 99.07,29.84 TTL.1
D45
  Top 0.178: U1.D45 100.34,23.49 100.34,9.53 97.8,6.98 96.53,6.98 96.53,4.44 LCD.6
D47
  Top 0.178: U1.D47 99.07,22.23 99.07,14.6 96.53,12.06 93.99,12.06 93.99,4.44 LCD.8
D49
  Bottom 0.178: U$3.2 90.18,23.49 95.26,23.49 U1.D49
D53
  Bottom 0.178: U$3.6 90.18,18.41 95.26,18.41 U1.D53
GND
  pour Top: 101.61,60.32 21.6,60.32 21.6,55.24 26.68,55.24 27.95,53.97 29.98,38.73 35.57,38.73 35.57,36.2 36.84,33.65 36.84,31.11 27.95,31.11 24.14,33.65 19.06,33.65 19.06,29.84 17.79,22.23 0.01,22.23 0.01,18.41 2.55,15.87 2.55,6.98 0.01,4.44 0.01,-0.64 101.61,-0.64
  pour Bottom: 101.61,60.32 21.6,60.32 21.6,55.24 26.68,55.24 27.95,53.97 29.98,38.73 35.57,38.73 35.57,36.2 36.84,33.65 36.84,31.11 27.95,31.11 24.14,33.65 19.06,33.65 19.06,29.84 17.79,22.23 0.01,22.23 0.01,18.41 2.55,15.87 2.55,6.98 0.01,4.44 0.01,-0.64 101.61,-0.64
GND_0  (via drill 0.38)
  Top 0.178: v71.13,43.81 68.59,41.27 v68.59,40 68.59,38.73 66.05,36.2 R26.1 | R23.1 41.92,45.09 v41.92,46.35 41.92,47.62 44.46,50.16 44.46,52.7 IC7.2 | v48.27,43.81 49.54,42.54 R11.2 | 2.5VY.2 63.51,1.9 40.65,1.9 40.65,5.71 39.38,6.98 36.84,6.98 36.84,18.41 38.11,19.69 38.11,27.3 34.3,31.11 34.3,33.91
  Bottom 0.178: v71.13,43.81 IC4.5 76.21,43.81 77.48,45.09 80.02,45.09 R1.E | 41.92,45.09 35.57,45.09 34.3,43.81 C3.2 34.3,42.54 31.76,40 29.22,40 29.02,39.97 | 41.92,45.09 47,45.09 v48.27,43.81 49.54,42.54 60.97,42.54 63.51,40 v68.59,40 | 41.92,45.09 v41.92,46.35 | 2.5VY.2 64.78,5.71 69.86,5.71 | 69.86,5.71 71.13,4.44 2.5V.2 | 2.048V.2 77.48,5.71 69.86,5.71
  pour Top: 20.33,60.32 0.01,60.32 0.01,23.49 15.25,23.49 15.25,26.03 17.79,29.84 17.79,34.92 25.41,34.92 27.95,32.38 34.3,32.38 34.3,37.46 29.48,37.46 26.68,52.7 20.33,52.7
  pour Bottom: 20.33,60.32 0.01,60.32 0.01,23.49 15.25,23.49 15.25,26.03 17.79,29.84 17.79,34.92 25.41,34.92 27.95,32.38 34.3,32.38 34.3,37.46 29.48,37.46 26.68,52.7 20.33,52.7
LED
  Top 0.178: R12.2 30.49,48.89 29.22,50.16 29.22,57.79 U1.D13
MISO
  Bottom 0.178: U$3.3 87.64,20.95 92.72,20.95 U1.D50
MOSI  (via drill 0.38)
  Top 0.178: v95.26,26.03 95.26,20.95 U1.D51
  Bottom 0.178: U$3.4 87.64,23.49 87.64,26.03 v95.26,26.03
N$1
  Top 0.178: LED3.C 29.22,13.33 27.95,14.6 27.95,22.23 Q2.D
  Bottom 0.178: 12VOUT.2 7.63,15.87 13.98,15.87 22.87,24.77 26.68,24.77 27.95,23.49 27.95,22.23 Q2.D
N$2  (via drill 0.38)
  Top 1.016: v15.25,45.09 11.44,48.89 11.44,52.7 7.63,56.51 15V.1
  Bottom 1.016: 26.68,43.81 26.68,47.62 29.22,47.62 34.3,52.7 41.92,52.7 IC7.1 | 26.68,43.81 26.68,41.27 IC2.1 | v15.25,45.09 16.52,43.81 26.68,43.81
N$3
  Bottom 1.016: !!!SCHEMATICDOESNOTREFLECTDESIGN.2 16.52,51.43 13.98,48.89 11.44,48.89 8.9,51.43 7.63,51.43 15V.2
N$4  (via drill 0.38)
  Top 0.178: v1.28,9.53 1.28,19.69 5.09,23.49 R16.1
  Bottom 0.178: v1.28,9.53 5.09,5.71 16.52,5.71 19.06,3.17 26.68,3.17 30.49,6.98 40.65,6.98 R4.A
N$5
  Top 0.178: R4.E 48.27,4.44 48.27,12.06 41.92,12.06 39.38,14.6 39.38,17.14 43.19,20.95 43.19,24.77 41.92,26.03 R17.2
N$6
  Top 0.178: 2.048V.1 71.13,6.98 71.13,20.95 73.67,23.49 73.67,32.38 78.75,32.38 78.75,34.92 80.02,36.2 80.02,40 77.48,42.54 77.48,45.09 76.21,46.35 IC4.6
  Bottom 0.178: IC4.6 78.75,46.35 81.29,48.89 83.83,48.89 R1.S
N$7  (via drill 0.38)
  Top 0.178: 13.98,5.71 15.25,4.44 15.25,3.17 LED4.C | 13.98,5.71 7.63,5.71 12VOUT.4 | v41.92,24.77 39.38,22.23 39.38,18.41 38.11,17.14 v38.11,12.06 | 13.98,5.71 v15.25,6.98
  Bottom 0.178: v41.92,24.77 44.46,27.3 45.73,27.3 Q1.D | v38.11,12.06 20.33,12.06 v15.25,6.98
N$8  (via drill 0.38)
  Top 0.178: v48.27,40 48.27,42.54 R11.1 | v41.92,37.46 43.19,36.2 43.19,26.03 45.73,23.49 50.81,23.49 50.81,12.06 49.54,10.79 49.54,6.98 R3.A
  Bottom 0.178: v48.27,40 45.73,37.46 v41.92,37.46
N$9  (via drill 0.38)
  Top 0.178: v78.75,42.54 78.75,45.09 R15.2 | v71.13,41.27 69.86,40 69.86,36.2 66.05,32.38 66.05,29.84 62.24,26.03 62.24,23.49 63.51,22.23 63.51,17.14 69.86,10.79 69.86,1.9 66.05,1.9 66.05,4.44 64.78,5.71 59.7,5.71 59.7,4.44 R3.E
  Bottom 0.178: v78.75,42.54 77.48,41.27 v71.13,41.27
N$10  (via drill 0.38)
  Top 0.178: v57.16,18.41 57.16,13.33 54.62,10.79 v54.62,6.98
  Bottom 0.178: 53.35,5.71 R4.S | 53.35,5.71 57.16,1.9 59.7,1.9 60.97,3.17 2.5VY.1 | IC6.5 63.51,27.3 63.51,22.23 59.7,18.41 v57.16,18.41 | 53.35,5.71 v54.62,6.98
N$11  (via drill 0.38)
  Top 0.178: 2.5V.1 68.59,4.44 v66.05,6.98 64.78,8.26 64.78,10.79 62.24,13.33 v62.24,22.23 | IC5.5 59.7,38.73 v59.7,28.57
  Bottom 0.178: R3.S 57.16,6.98 v66.05,6.98 | v59.7,28.57 59.7,27.3 62.24,24.77 v62.24,22.23
N$12
  Top 0.178: U$1.2 10.17,33.65 7.63,33.65 U$1.1 7.63,34.92 3.82,34.92 2.55,36.2 GALVOX.2
N$13
  Top 0.178: 7.63,41.27 10.17,41.27 U$1.7 | 7.63,41.27 2.55,41.27 2.55,40 GALVOX.1 | 7.63,41.27 U$1.8
N$14  (via drill 0.38)
  Top 0.178: v40.65,38.73 39.38,37.46 R5.2
  Bottom 0.178: v40.65,38.73 43.19,41.27 54.62,41.27 | IC5.7 54.62,41.27 | IC5.6 57.16,41.27 54.62,41.27
N$15  (via drill 0.38)
  Top 0.178: v25.41,33.65 22.87,33.65 R18.2 | v40.65,34.92 39.38,34.92 R5.1
  Bottom 0.178: v25.41,33.65 27.95,31.11 36.84,31.11 v40.65,34.92 53.35,34.92 IC5.2
N$16  (via drill 0.38)
  Top 0.178: v69.86,45.09 69.86,43.81 67.32,41.27 67.32,40 R7.2
  Bottom 0.178: v69.86,45.09 73.67,48.89 IC4.7
N$17  (via drill 0.38)
  Top 0.178: R26.2 66.05,33.65 63.51,33.65 v63.51,34.92 63.51,37.46 64.78,38.73 64.78,40 R7.1
  Bottom 0.178: IC5.3 60.97,34.92 v63.51,34.92
N$18  (via drill 0.38)
  Top 0.178: v34.3,29.84 27.95,29.84 R6.2 | IC6.6 57.16,31.11 IC6.7
  Bottom 0.178: v34.3,29.84 36.84,29.84 40.65,33.65 47,33.65 52.08,28.57 54.62,28.57 IC6.7
N$19
  Top 0.178: LEDA.1 99.07,53.97 97.8,52.7 97.8,50.16 100.34,47.62 R27.1
N$20  (via drill 0.38)
  Top 0.178: 26.68,27.3 25.41,26.03 R19.2 | 26.68,27.3 26.68,29.84 R6.1 | v29.22,28.57 27.95,27.3 26.68,27.3
  Bottom 0.178: IC6.2 54.62,23.49 41.92,23.49 36.84,28.57 v29.22,28.57
N$21  (via drill 0.38)
  Top 0.178: v55.89,46.35 54.62,45.09 52.08,47.62 52.08,48.89 R8.2 48.27,48.89
  Bottom 0.178: v55.89,46.35 57.16,45.09 60.97,45.09 62.24,43.81 IC4.4
N$22
  Top 0.178: 45.73,46.35 47,47.62 47,48.89 R8.1 | 45.73,46.35 44.46,45.09 R23.2 | IC6.3 49.54,31.11 49.54,37.46 45.73,41.27 45.73,46.35
N$23
  Top 0.178: LEDB.1 99.07,33.65 97.8,34.92 97.8,37.46 100.34,40 R28.1
N$24
  Top 0.178: U$4.2 11.44,23.49 8.9,23.49 U$4.1 8.9,24.77 7.63,26.03 7.63,27.3 6.36,28.57 2.55,28.57 GALVOY.2
N$25
  Top 0.178: 8.9,31.11 11.44,31.11 U$4.7 | 8.9,31.11 2.55,31.11 GALVOY.1 | 8.9,31.11 U$4.8
N$29
  Bottom 0.178: R29.S 86.37,5.71 88.91,3.17 88.91,1.9 96.53,1.9 LCD.4
N$37
  Top 0.178: JP6.3 U$8.MS2
N$38
  Top 0.178: U$8.SLP 71.13,32.38 U$8.RST
N$39
  Top 0.178: JP6.5 U$8.MS3
N$40  (via drill 0.38)
  Top 0.178: v54.62,38.73 54.62,41.27 53.35,42.54 53.35,43.81 R10.1 | v81.29,33.65 81.29,32.38 U$8.MS1 81.29,29.84 81.29,28.57 JP6.1
  Bottom 0.178: v54.62,38.73 55.89,37.46 77.48,37.46 v81.29,33.65
N$41
  Bottom 0.178: U$8.2B 80.02,15.87 81.29,15.87 Z-MOT1.1
N$42
  Bottom 0.178: U$8.2A 77.48,15.87 78.75,15.87 Z-MOT1.2
N$43
  Bottom 0.178: U$8.1A 74.94,15.87 76.21,15.87 Z-MOT1.3
N$44
  Bottom 0.178: U$8.1B 72.4,15.87 73.67,15.87 Z-MOT1.4
N$45  (via drill 0.38)
  Top 0.178: v33.03,14.6 31.76,13.33 LED3.A | v40.65,14.6 40.65,15.87 R24.2
  Bottom 0.178: v40.65,14.6 v33.03,14.6
N$46
  Top 0.178: LED1.A 31.76,38.73 29.22,41.27 29.22,43.81 30.49,45.09 30.49,46.35 R12.1
N$47
  Top 0.178: R14.2 25.41,10.79 26.68,12.06 26.68,19.69 25.41,20.95 25.41,22.23 Q2.G
N$48
  Top 0.178: R13.2 47,36.2 47,31.11 Q1.G
N$50
  Top 0.178: LED4.A 12.71,3.17 13.98,1.9 16.52,1.9 16.52,10.79 15.25,12.06 15.25,18.41 16.52,19.69 16.52,20.95 R25.2
N$54
  Top 1.016: 12V.1 19.06,8.26 19.06,9.53 20.33,10.79 20.33,17.14 F1.2
NEG_6V  (via drill 0.38)
  Top 0.178: 60.97,24.77 60.97,26.03 63.51,28.57 63.51,29.84 IC5.4 | 60.97,24.77 IC6.4 | 16.52,46.35 16.52,48.89 C4.1 | 16.52,46.35 16.52,43.81 15.25,42.54 U$1.5 | 21.6,48.89 25.41,48.89 C5.1 | 21.6,48.89 19.06,51.43 !!!SCHEMATICDOESNOTREFLECTDESIGN.3 | 16.52,46.35 21.6,46.35 21.6,48.89 | v58.43,24.77 60.97,24.77 | v40.65,32.38 38.11,32.38 38.11,34.92 36.84,36.2 36.84,43.81 31.76,48.89 31.76,50.16 v30.49,51.43
  Bottom 0.178: v58.43,24.77 55.89,27.3 52.08,27.3 47,32.38 v40.65,32.38 | v30.49,51.43 27.95,48.89 25.41,48.89 C5.1
POS_5V  (via drill 0.38)
  Top 0.178: 81.29,51.43 81.29,45.09 R15.1 | R1.A 81.29,51.43 | 81.29,51.43 IC4.8 | R17.1 39.38,27.3 35.57,31.11 35.57,32.38 C1.1 | v47,43.81 v49.54,46.35
  Bottom 0.178: 31.76,36.2 33.03,36.2 35.57,33.65 C1.1 | 31.76,36.2 26.68,36.2 IC2.3 | IC4.8 74.94,55.24 55.89,55.24 53.35,52.7 53.35,46.35 v49.54,46.35 | v47,43.81 45.73,42.54 38.11,42.54 31.76,36.2
POS_6V  (via drill 0.38)
  Top 0.178: IC6.8 50.81,32.38 50.81,37.46 IC5.8 52.08,41.27 52.08,43.81 50.81,45.09 v50.81,47.62 | U$1.6 12.71,41.27 15.25,38.73 16.52,38.73 17.79,40 C7.1 19.06,40 22.87,43.81 v27.95,43.81
  Bottom 0.178: 33.03,45.09 34.3,46.35 40.65,46.35 44.46,50.16 45.73,50.16 47,51.43 | 33.03,45.09 31.76,43.81 C3.1 | 47,51.43 48.27,52.7 IC7.3 | v27.95,43.81 29.22,45.09 33.03,45.09 | 47,51.43 v50.81,47.62
RESET
  Top 0.178: U1.RES 36.84,5.71 36.84,3.17 38.11,1.9 S1.2
SCK
  Bottom 0.178: U$3.5 83.83,17.14 83.83,15.87 85.1,14.6 90.18,14.6 92.72,17.14 U1.D52
SCL
  Top 0.178: U1.D21 88.91,57.79 | 88.91,57.79 90.18,57.79 R22.1 | 88.91,57.79 88.91,59.05 67.32,59.05 66.05,57.79 66.05,52.7 63.51,50.16 I2C.4
SDA  (via drill 0.38)
  Top 0.178: v88.91,52.7 88.91,48.89 90.18,47.62 R21.1
  Bottom 0.178: U1.D20 86.37,55.24 | 86.37,55.24 v88.91,52.7 | 86.37,55.24 82.56,55.24 77.48,50.16 73.67,50.16 69.86,53.97 67.32,53.97 64.78,51.43 62.24,51.43 60.97,50.16 I2C.3
T2_5  (via drill 0.38)
  Top 0.178: v17.79,34.92 17.79,33.65 16.52,32.38 U$4.5
  Bottom 0.178: v17.79,34.92 12.71,40 12.71,46.35 25.41,46.35 C5.2
T2_6
  Top 0.178: U$4.6 13.98,34.92 16.52,37.46 17.79,37.46 C7.2
VCC
  Top 0.178: R29.A 82.56,1.9 88.91,1.9 LCD.10 87.64,5.71 87.64,12.06 91.45,15.87 91.45,24.77 88.91,27.3 | 90.18,45.09 87.64,45.09 87.64,52.7 90.18,55.24 | 90.18,55.24 91.45,55.24 U1.5V@1 U1.5V@2 | 90.18,55.24 R22.2 | 52.08,50.16 53.35,48.89 53.35,47.62 55.89,47.62 SERIAL.1 | 52.08,50.16 I2C.1 55.89,50.16 | 52.08,50.16 VCC.1 52.08,51.43 53.35,52.7 A-OUT.1 | Z-.3 71.13,36.2 71.13,38.73 Z+.3 | JP6.4 JP6.6 | 87.64,26.03 R20.1 | U$3.1 87.64,26.03 | 90.18,45.09 90.18,28.57 88.91,27.3 | 87.64,26.03 88.91,27.3 | 90.18,45.09 R21.2
  Bottom 0.178: 67.32,12.06 U$8.VDD | 67.32,12.06 68.59,12.06 73.67,6.98 77.48,6.98 R29.A | U1.5V@0 39.38,8.26 40.65,8.26 41.92,6.98 45.73,6.98 50.81,12.06 67.32,12.06 | 81.29,23.49 JP6.2 | 81.29,23.49 85.1,23.49 U$3.1 | JP6.4 78.75,23.49 81.29,23.49 | Z-.3 68.59,34.92 66.05,32.38 66.05,24.77 JP6.6 | Z+.3 71.13,40 69.86,41.27 63.51,41.27 60.97,43.81 54.62,43.81 54.62,46.35 55.89,47.62 SERIAL.1
X_IN  (via drill 0.38)
  Top 0.178: 20.33,33.65 17.79,36.2 16.52,36.2 15.25,34.92 U$1.4 | IC5.1 52.08,33.65 v52.08,36.2 | v34.3,36.2 29.22,36.2 29.22,34.92 25.41,31.11 20.33,31.11 20.33,33.65 | 20.33,33.65 R18.1
  Bottom 0.178: v34.3,36.2 v52.08,36.2
Y_IN  (via drill 0.38)
  Top 0.178: 21.6,23.49 24.14,26.03 R19.1 | 21.6,23.49 16.52,23.49 U$4.4 | 21.6,23.49 v21.6,22.23
  Bottom 0.178: IC6.1 49.54,18.41 25.41,18.41 v21.6,22.23
Z-DIR  (via drill 0.38)
  Top 0.178: v67.32,23.49 68.59,22.23 v68.59,17.14
  Bottom 0.178: U$8.DIR 64.78,23.49 v67.32,23.49 | v68.59,17.14 73.67,12.06 97.8,12.06 99.07,13.33 99.07,20.95 95.26,20.95 U1.D48
Z-EN
  Top 0.178: U$8.EN 83.83,31.11 | 83.83,31.11 87.64,31.11 R20.2 | U1.A8 76.21,12.06 78.75,12.06 78.75,19.69 82.56,23.49 82.56,28.57 83.83,29.84 83.83,31.11
Z-MAX  (via drill 0.38)
  Top 0.178: U1.D19 86.37,52.7 86.37,48.89 v80.02,42.54
  Bottom 0.178: Z+.1 v80.02,42.54
Z-MIN
  Top 0.178: U1.D18 72.4,51.43 72.4,42.54 73.67,41.27 73.67,38.73 74.94,37.46 77.48,37.46 Z-.1
Z-STEP  (via drill 0.38)
  Top 0.178: v91.45,32.38 91.45,27.3 U1.D46
  Bottom 0.178: U$8.STEP 69.86,33.65 72.4,33.65 73.67,32.38 v91.45,32.38
(copper drawn outside any net)
  shapes: Bottom circle x1

### Text on the board
tNames: + | - | G | + | G | + | + | G | G
bNames: C 2012 Hawkinsoft LLC - Lamps 1.0
Document: LAMPS 0.1 (Laser Arduino MEGA Pololu Shield) | GPL v3 | Reversing input power, and inserting stepper drivers incorrectly will destroy electronics. | I2C | 21 | 20 | GND | 5V | AUX-4 | D16 | D17 | D23 | D25 | D27 | D29 | D31 | D33 | 12-35V Out | D35 | - | D37 | D10 | D38 | + | D41 | - | D43 | D9 | D45 | + | AUX-3 / SPI | AUX-1 | D47 | 5A | 12-35VDC In | SCK | MISO | D32 | 5V | GND | D2 | D1 | GND | D52 | D50 | 5V | GND | + | 5V | GND | A3 | A4 | NC | D53 | MOSI | D49 | D57 | D58 | D51 | 5V | -
_tsilk: 1 | AUX-4 | 1